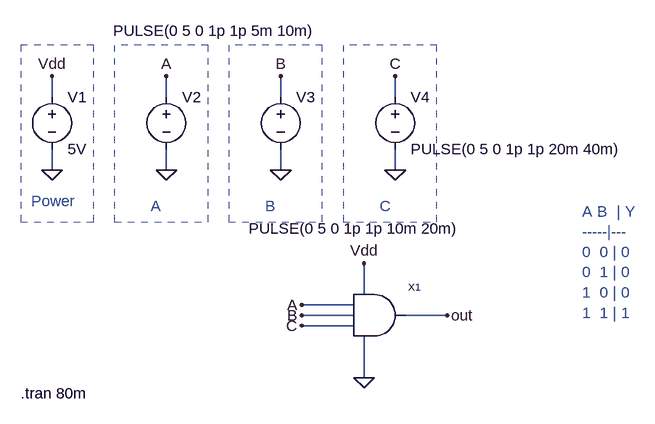
[diagram p0: schematic and3_block.asc]
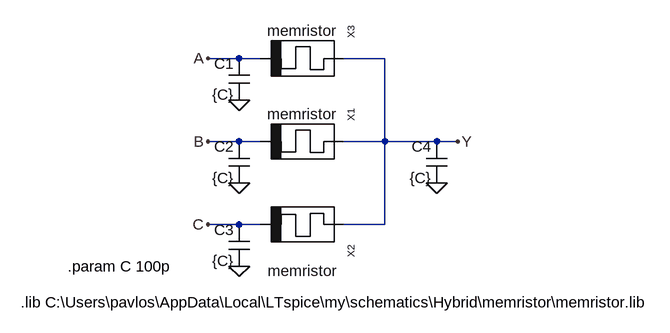
[diagram p1: sub-circuit and3.asc]
and3_block.asc, the LTspice schematic file:
Version 4
SHEET 1 880 680
WIRE -560 -416 -560 -448
WIRE -384 -416 -384 -448
WIRE -208 -416 -208 -448
WIRE -32 -416 -32 -448
WIRE -560 -304 -560 -336
WIRE -384 -304 -384 -336
WIRE -208 -304 -208 -336
WIRE -32 -304 -32 -336
WIRE -80 -112 -80 -160
WIRE -96 -96 -176 -96
WIRE -96 -80 -176 -80
WIRE 48 -80 -16 -80
WIRE -96 -64 -176 -64
WIRE -80 16 -80 -48
FLAG 48 -80 out
FLAG -176 -96 A
FLAG -80 -160 Vdd
FLAG -80 16 0
FLAG -560 -304 0
FLAG -560 -448 Vdd
FLAG -384 -304 0
FLAG -384 -448 A
FLAG -176 -64 C
FLAG -208 -304 0
FLAG -208 -448 B
FLAG -176 -80 B
FLAG -32 -304 0
FLAG -32 -448 C
SYMBOL voltage -560 -432 R0
WINDOW 123 0 0 Left 0
WINDOW 39 0 0 Left 0
SYMATTR InstName V1
SYMATTR Value 5V
SYMBOL voltage -384 -432 R0
WINDOW 123 0 0 Left 0
WINDOW 39 0 0 Left 0
WINDOW 3 -82 -86 Left 2
SYMATTR Value PULSE(0 5 0 1p 1p 5m 10m)
SYMATTR InstName V2
SYMBOL voltage -208 -432 R0
WINDOW 123 0 0 Left 0
WINDOW 39 0 0 Left 0
WINDOW 3 -49 218 Left 2
SYMATTR Value PULSE(0 5 0 1p 1p 10m 20m)
SYMATTR InstName V3
SYMBOL voltage -32 -432 R0
WINDOW 123 0 0 Left 0
WINDOW 39 0 0 Left 0
SYMATTR InstName V4
SYMATTR Value PULSE(0 5 0 1p 1p 20m 40m)
SYMBOL and3 -96 -48 R0
SYMATTR InstName X1
TEXT -592 -256 Left 2 ;Power
TEXT -408 -248 Left 2 ;A
TEXT -608 40 Left 2 !.tran 80m
TEXT -232 -248 Left 2 ;B
TEXT 256 -240 Left 2 ;A B  | Y\n-----|---\n0  0 | 0\n0  1 | 0\n1  0 | 0\n1  1 | 1
TEXT -56 -248 Left 2 ;C
RECTANGLE Normal -496 -496 -608 -224 2
RECTANGLE Normal -320 -496 -464 -224 2
RECTANGLE Normal -144 -496 -288 -224 2
RECTANGLE Normal 32 -496 -112 -224 2

and3.asc, the sub-circuit schematic file:
Version 4
SHEET 1 880 680
WIRE -336 -576 -384 -576
WIRE -304 -576 -336 -576
WIRE -112 -576 -176 -576
WIRE -336 -448 -384 -448
WIRE -304 -448 -336 -448
WIRE -112 -448 -112 -576
WIRE -112 -448 -176 -448
WIRE -32 -448 -112 -448
WIRE 0 -448 -32 -448
WIRE -336 -320 -384 -320
WIRE -304 -320 -336 -320
WIRE -112 -320 -112 -448
WIRE -112 -320 -176 -320
FLAG 0 -448 Y
FLAG -384 -448 B
FLAG -384 -320 C
FLAG -32 -384 0
FLAG -336 -384 0
FLAG -336 -256 0
FLAG -384 -576 A
FLAG -336 -512 0
SYMBOL cap -16 -448 M0
SYMATTR InstName C4
SYMATTR Value {C}
SYMBOL memristor -240 -448 M270
WINDOW 3 58 -1 VBottom 2
WINDOW 39 79 -4 VBottom 2
SYMATTR InstName X1
SYMBOL memristor -240 -320 R90
WINDOW 3 56 -2 VTop 2
WINDOW 39 82 4 VTop 2
SYMATTR InstName X2
SYMBOL cap -320 -448 M0
SYMATTR InstName C2
SYMATTR Value {C}
SYMBOL cap -320 -320 M0
SYMATTR InstName C3
SYMATTR Value {C}
SYMBOL memristor -240 -576 M270
WINDOW 3 58 -1 VBottom 2
WINDOW 39 79 -4 VBottom 2
SYMATTR InstName X3
SYMBOL cap -320 -576 M0
SYMATTR InstName C1
SYMATTR Value {C}
TEXT -672 -200 Left 2 !.lib C:\\Users\\pavlos\\AppData\\Local\\LTspice\\my\\schematics\\Hybrid\\memristor\\memristor.lib
TEXT -600 -256 Left 2 !.param C 100p

The netlist it stands for:
* and3_block.asc
V1 Vdd 0 5V
V2 A 0 PULSE(0 5 0 1p 1p 5m 10m)
V3 B 0 PULSE(0 5 0 1p 1p 10m 20m)
V4 C 0 PULSE(0 5 0 1p 1p 20m 40m)
XX1 A B C out Vdd 0 and3

* block symbol definitions
.subckt and3 A B C Y Vdd Vss
C4 Y 0 {C}
XX1 Y B memristor  ; pins plus minus
XX2 Y C memristor  ; pins plus minus
C2 B 0 {C}
C3 C 0 {C}
XX3 Y A memristor  ; pins plus minus
C1 A 0 {C}
.lib C:\Users\pavlos\AppData\Local\LTspice\my\schematics\Hybrid\memristor\memristor.lib
.param C 100p
.ends and3

* Power
* A
.tran 80m
* B
* A B  | Y
* -----|---
* 0  0 | 0
* 0  1 | 0
* 1  0 | 0
* 1  1 | 1
* C
.backanno
.end